# EAGLE schematic bin-to-dec_tube-driver (EAGLE 9.6.2)
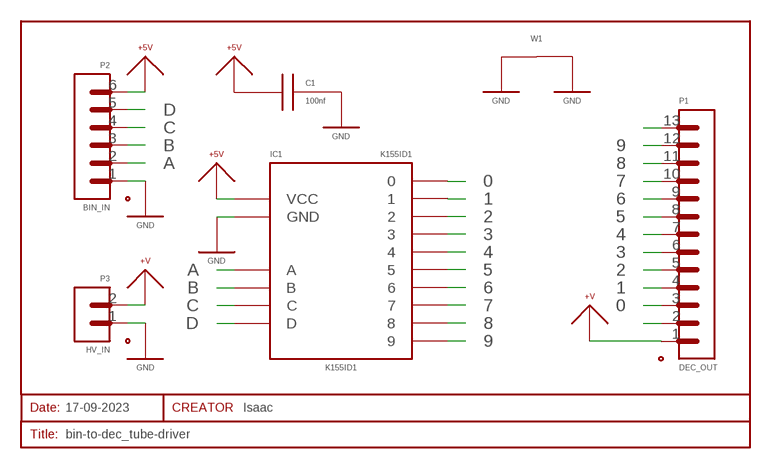
[diagram p0: schematic, sheet 1]

## Parts
C1  100nf  CAPACITOR_UNPOLARISED_5.08MM  [CAPACITOR_UNPOLARISED_5.08MM]
CREATOR  Isaac  INFO_T  [INFO_T]
IC1  K155ID1  K155ID1_DIP  [16-PIN_DIP]
P1  DEC_OUT  PORT_13-PIN_HEADER  [HEADER_13-PIN]
P2  BIN_IN  PORT_6-PIN_XH2.54  [XH2.54_6-PIN]
P3  HV_IN  PORT_2-PIN_XH2.54  [XH2.54_2-PIN]
SCHEMATIC1  17-09-2023  SHEET  [SHEET]
W1  WIRE_7.62MM  [WIRE_7.62MM]

## Nets
0: IC1.16 P1.3
1: IC1.15 P1.4
2: IC1.8 P1.5
3: IC1.9 P1.6
4: IC1.13 P1.7
5: IC1.14 P1.8
6: IC1.11 P1.9
7: IC1.10 P1.10
8: IC1.1 P1.11
9: IC1.2 P1.12
+5V: C1.1 IC1.5(VCC) P2.6
+V: P1.1 P3.2
A: IC1.3(A) P2.2
B: IC1.6(B) P2.3
C: IC1.7(C) P2.4
D: IC1.4(D) P2.5
GND: C1.2 IC1.12(GND) P2.1 P3.1 W1.1 W1.2
N$16: P1.2
N$17: P1.13

## Library data of the parts
C1 = myLibrary:CAPACITOR_UNPOLARISED
CREATOR = myLibrary:INFO
IC1 = myLibrary:K155ID1
P1 = myLibrary:PORT_13-PIN
P2 = myLibrary:PORT_6-PIN
P3 = myLibrary:PORT_2-PIN
SCHEMATIC1 = myLibrary:SHEET
W1 = myLibrary:WIRE